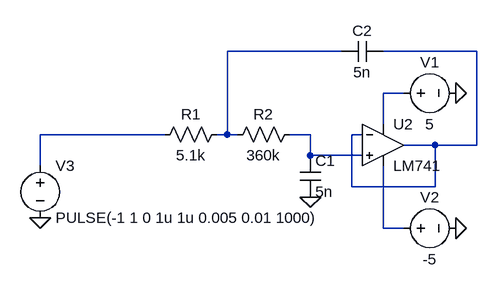
[diagram p0: schematic Lab8_OD.asc]
Lab8_OD.asc, the LTspice schematic file:
Version 4.1
SHEET 1 880 680
WIRE 80 32 -96 32
WIRE 288 32 144 32
WIRE 176 96 144 96
WIRE 144 144 144 96
WIRE -192 160 -384 160
WIRE -96 160 -96 32
WIRE -96 160 -112 160
WIRE -80 160 -96 160
WIRE 32 160 0 160
WIRE 112 160 96 160
WIRE 224 176 176 176
WIRE 288 176 288 32
WIRE 288 176 224 176
WIRE 32 192 32 160
WIRE 112 192 32 192
WIRE -384 208 -384 160
WIRE 96 240 96 160
WIRE 224 240 224 176
WIRE 224 240 96 240
WIRE 144 304 144 208
WIRE 176 304 144 304
FLAG 32 256 0
FLAG 256 96 0
FLAG 256 304 0
FLAG -384 288 0
SYMBOL cap 16 192 R0
SYMATTR InstName C1
SYMATTR Value 5n
SYMBOL cap 144 16 R90
WINDOW 0 0 32 VBottom 2
WINDOW 3 32 32 VTop 2
SYMATTR InstName C2
SYMATTR Value 5n
SYMBOL res 16 144 R90
WINDOW 0 0 56 VBottom 2
WINDOW 3 32 56 VTop 2
SYMATTR InstName R2
SYMATTR Value 360k
SYMBOL res -96 144 R90
WINDOW 0 0 56 VBottom 2
WINDOW 3 32 56 VTop 2
SYMATTR InstName R1
SYMATTR Value 5.1k
SYMBOL LM741 144 112 R0
SYMATTR InstName U2
SYMBOL voltage 160 96 R270
WINDOW 0 32 56 VTop 2
WINDOW 3 -32 56 VBottom 2
WINDOW 123 0 0 Left 0
WINDOW 39 0 0 Left 0
SYMATTR InstName V1
SYMATTR Value 5
SYMBOL voltage 160 304 R270
WINDOW 0 32 56 VTop 2
WINDOW 3 -32 56 VBottom 2
WINDOW 123 0 0 Left 0
WINDOW 39 0 0 Left 0
SYMATTR InstName V2
SYMATTR Value -5
SYMBOL voltage -384 192 R0
WINDOW 123 0 0 Left 0
WINDOW 39 0 0 Left 0
SYMATTR InstName V3
SYMATTR Value PULSE(-1 1 0 1u 1u 0.005 0.01 1000)

The netlist it stands for:
* Lab8_OD.asc
C1 N005 0 5n
C2 N002 N001 5n
R2 N005 N001 360k
R1 N001 N004 5.1k
X§U2 N005 N002 N003 N006 N002 LM741  ; pins In+ In- V+ V- OUT
V1 N003 0 5
V2 N006 0 -5
V3 N004 0 PULSE(-1 1 0 1u 1u 0.005 0.01 1000)
.lib LM741.lib
.backanno
.end